# Altium schematic sheet 05_LMS1_Misc.SchDoc: LMS7002M misc (LMS1)
size A3; Organization: Lime Microsystems; Address1: Surrey Tech Centre; Address2: Guildford GU2 7YG; Address3: Surrey; Address4: United Kingdom; SheetNumber: 5
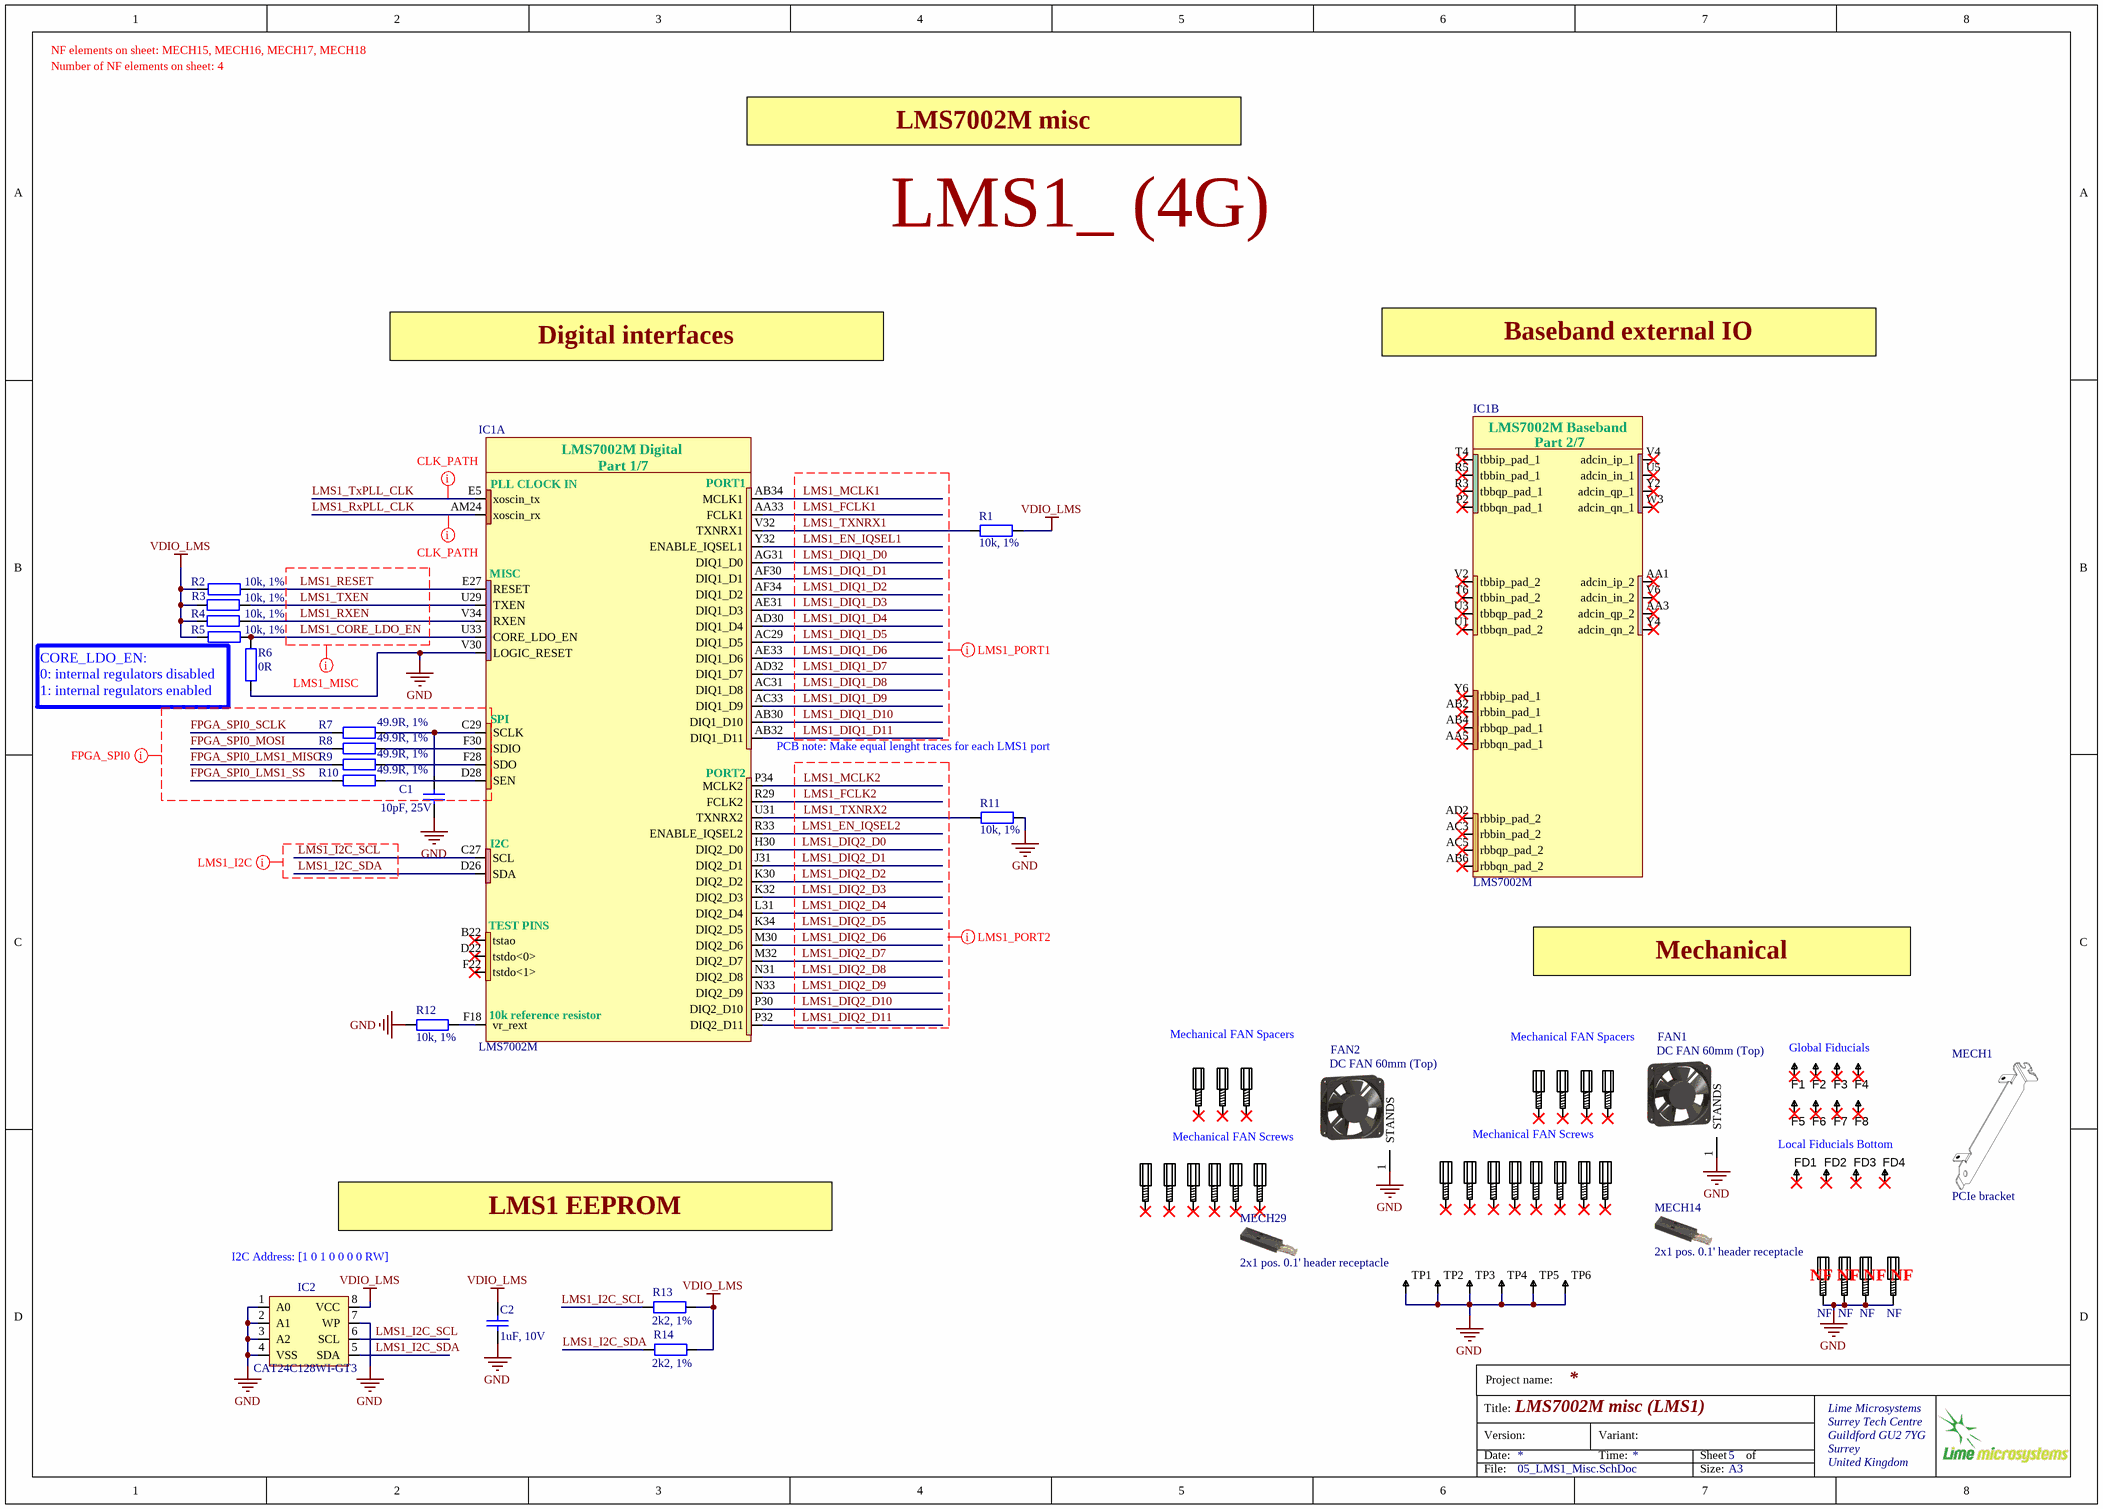
[diagram p0: 05_LMS1_Misc.SchDoc]

## Parts
C1  10pF, 25V  [CAP0402]
C2  1uF, 10V  [CAP0402]
F1  Fiducial  [Fiducial]  (value not drawn)
F2  Fiducial  [Fiducial]  (value not drawn)
F3  Fiducial  [Fiducial]  (value not drawn)
F4  Fiducial  [Fiducial]  (value not drawn)
F5  Fiducial  [Fiducial]  (value not drawn)
F6  Fiducial  [Fiducial]  (value not drawn)
F7  Fiducial  [Fiducial]  (value not drawn)
F8  Fiducial  [Fiducial]  (value not drawn)
FAN1  DC FAN 60mm (Top)  [FAN_60mm]
FAN2  DC FAN 60mm (Top)  [FAN_60mm]
FD1  Fiducial  [Fiducial_local]  (value not drawn)
FD2  Fiducial  [Fiducial_local]  (value not drawn)
FD3  Fiducial  [Fiducial_local]  (value not drawn)
FD4  Fiducial  [Fiducial_local]  (value not drawn)
IC1  LMS7002M  [LMS7002M_v5]  (parts A,B of 7)
IC2  CAT24C128WI-GT3  [SOIC127P600-8DL_v2]
MECH1  PCIe bracket  [PCIe_bracket]  (mechanical)
MECH2  Spacer M3  (value not drawn)  (mechanical)
MECH3  Spacer M3  (value not drawn)  (mechanical)
MECH4  Spacer M3  (value not drawn)  (mechanical)
MECH5  Spacer M3  (value not drawn)  (mechanical)
MECH6  Screws M3  (value not drawn)  (mechanical)
MECH7  Screws M3  (value not drawn)  (mechanical)
MECH8  Screws M3  (value not drawn)  (mechanical)
MECH9  Screws M3  (value not drawn)  (mechanical)
MECH10  Screws M3  (value not drawn)  (mechanical)
MECH11  Screws M3  (value not drawn)  (mechanical)
MECH12  Screws M3  (value not drawn)  (mechanical)
MECH13  Screws M3  (value not drawn)  (mechanical)
MECH14  2x1 pos. 0.1' header receptacle  (mechanical)
MECH15  Assembly Info: NF  [PCB_standoff]  (hidden comment: Standoff)
MECH16  Assembly Info: NF  [PCB_standoff]  (hidden comment: Standoff)
MECH17  Assembly Info: NF  [PCB_standoff]  (hidden comment: Standoff)
MECH18  Assembly Info: NF  [PCB_standoff]  (hidden comment: Standoff)
MECH20  Spacer M3  (value not drawn)  (mechanical)
MECH21  Spacer M3  (value not drawn)  (mechanical)
MECH22  Spacer M3  (value not drawn)  (mechanical)
MECH23  Screws M3  (value not drawn)  (mechanical)
MECH24  Screws M3  (value not drawn)  (mechanical)
MECH25  Screws M3  (value not drawn)  (mechanical)
MECH26  Screws M3  (value not drawn)  (mechanical)
MECH27  Screws M3  (value not drawn)  (mechanical)
MECH28  Screws M3  (value not drawn)  (mechanical)
MECH29  2x1 pos. 0.1' header receptacle  (mechanical)
R1  10k, 1%  [RES0402]
R2  10k, 1%  [RES0402]
R3  10k, 1%  [RES0402]
R4  10k, 1%  [RES0402]
R5  10k, 1%  [RES0402]
R6  0R  [RES0402]
R7  49.9R, 1%  [RES0402]
R8  49.9R, 1%  [RES0402]
R9  49.9R, 1%  [RES0402]
R10  49.9R, 1%  [RES0402]
R11  10k, 1%  [RES0402]
R12  10k, 1%  [RES0402]
R13  2k2, 1%  [RES0402]
R14  2k2, 1%  [RES0402]
TP1  TESTPOINT_THT_MINI  [TP-SMD-LOW_PROFILE]  (value not drawn)
TP2  TESTPOINT_THT_MINI  [TP-SMD-LOW_PROFILE]  (value not drawn)
TP3  TESTPOINT_THT_MINI  [TP-SMD-LOW_PROFILE]  (value not drawn)
TP4  TESTPOINT_THT_MINI  [TP-SMD-LOW_PROFILE]  (value not drawn)
TP5  TESTPOINT_THT_MINI  [TP-SMD-LOW_PROFILE]  (value not drawn)
TP6  TESTPOINT_THT_MINI  [TP-SMD-LOW_PROFILE]  (value not drawn)

## Nets
GND: C1.2 C2.2 FAN1.1(STANDS) FAN2.1(STANDS) IC1.V30(LOGIC_RESET) IC2.1(A0) IC2.2(A1) IC2.3(A2) IC2.4(VSS) IC2.7(WP) MECH15.MH1 MECH16.MH1 MECH17.MH1 MECH18.MH1 R6.1 R11.1 R12.2 TP1.1 TP2.1 TP3.1 TP4.1 TP5.1 TP6.1
VDIO_LMS: C2.1 IC2.8(VCC) R1.2 R2.2 R3.1 R4.1 R5.2 R13.1 R14.1
FPGA_SPI0_LMS1_MISO: R9.2
FPGA_SPI0_LMS1_SS: R10.2
FPGA_SPI0_MOSI: R8.2
FPGA_SPI0_SCLK: R7.2
LMS1_CORE_LDO_EN: IC1.U33(CORE_LDO_EN) R5.1 R6.2
LMS1_DIQ1_D0: IC1.AG31(DIQ1_D0)
LMS1_DIQ1_D1: IC1.AF30(DIQ1_D1)
LMS1_DIQ1_D2: IC1.AF34(DIQ1_D2)
LMS1_DIQ1_D3: IC1.AE31(DIQ1_D3)
LMS1_DIQ1_D4: IC1.AD30(DIQ1_D4)
LMS1_DIQ1_D5: IC1.AC29(DIQ1_D5)
LMS1_DIQ1_D6: IC1.AE33(DIQ1_D6)
LMS1_DIQ1_D7: IC1.AD32(DIQ1_D7)
LMS1_DIQ1_D8: IC1.AC31(DIQ1_D8)
LMS1_DIQ1_D9: IC1.AC33(DIQ1_D9)
LMS1_DIQ1_D10: IC1.AB30(DIQ1_D10)
LMS1_DIQ1_D11: IC1.AB32(DIQ1_D11)
LMS1_DIQ2_D0: IC1.H30(DIQ2_D0)
LMS1_DIQ2_D1: IC1.J31(DIQ2_D1)
LMS1_DIQ2_D2: IC1.K30(DIQ2_D2)
LMS1_DIQ2_D3: IC1.K32(DIQ2_D3)
LMS1_DIQ2_D4: IC1.L31(DIQ2_D4)
LMS1_DIQ2_D5: IC1.K34(DIQ2_D5)
LMS1_DIQ2_D6: IC1.M30(DIQ2_D6)
LMS1_DIQ2_D7: IC1.M32(DIQ2_D7)
LMS1_DIQ2_D8: IC1.N31(DIQ2_D8)
LMS1_DIQ2_D9: IC1.N33(DIQ2_D9)
LMS1_DIQ2_D10: IC1.P30(DIQ2_D10)
LMS1_DIQ2_D11: IC1.P32(DIQ2_D11)
LMS1_EN_IQSEL1: IC1.Y32(ENABLE_IQSEL1)
LMS1_EN_IQSEL2: IC1.R33(ENABLE_IQSEL2)
LMS1_FCLK1: IC1.AA33(FCLK1)
LMS1_FCLK2: IC1.R29(FCLK2)
LMS1_I2C_SCL: IC1.C27(SCL) IC2.6(SCL) R13.2
LMS1_I2C_SDA: IC1.D26(SDA) IC2.5(SDA) R14.2
LMS1_MCLK1: IC1.AB34(MCLK1)
LMS1_MCLK2: IC1.P34(MCLK2)
LMS1_RESET: IC1.E27(RESET) R2.1
LMS1_RXEN: IC1.V34(RXEN) R4.2
LMS1_RxPLL_CLK: IC1.AM24(xoscin_rx)
LMS1_TXEN: IC1.U29(TXEN) R3.2
LMS1_TXNRX1: IC1.V32(TXNRX1) R1.1
LMS1_TXNRX2: IC1.U31(TXNRX2) R11.2
LMS1_TxPLL_CLK: IC1.E5(xoscin_tx)
NetC1_1: C1.1 IC1.C29(SCLK) R7.1
NetIC1_D28: IC1.D28(SEN) R10.1
NetIC1_F18: IC1.F18(vr_rext) R12.1
NetIC1_F28: IC1.F28(SDO) R9.1
NetIC1_F30: IC1.F30(SDIO) R8.1

Not connected (* = marked no-connect by the designer): F1 1*; F2 1*; F3 1*; F4 1*; F5 1*; F6 1*; F7 1*; F8 1*; FD1 1*; FD2 1*; FD3 1*; FD4 1*; IC1 AA1(adcin_ip_2)* AA3(adcin_qp_2)* AA5(rbbqn_pad_1)* AB2(rbbin_pad_1)* AB4(rbbqp_pad_1)* AB6(rbbqn_pad_2)* AC3(rbbin_pad_2)* AC5(rbbqp_pad_2)* AD2(rbbip_pad_2)* B22(tstao)* D22(tstdo<0>)* F22(tstdo<1>)* P2(tbbqn_pad_1)* R3(tbbqp_pad_1)* R5(tbbin_pad_1)* T4(tbbip_pad_1)* T6(tbbin_pad_2)* U1(tbbqn_pad_2)* U3(tbbqp_pad_2)* U5(adcin_in_1)* V2(tbbip_pad_2)* V4(adcin_ip_1)* V6(adcin_in_2)* W3(adcin_qn_1)* Y2(adcin_qp_1)* Y4(adcin_qn_2)* Y6(rbbip_pad_1)*; MECH2 MH1*; MECH3 MH1*; MECH4 MH1*; MECH5 MH1*; MECH6 MH1*; MECH7 MH1*; MECH8 MH1*; MECH9 MH1*; MECH10 MH1*; MECH11 MH1*; MECH12 MH1*; MECH13 MH1*; MECH20 MH1*; MECH21 MH1*; MECH22 MH1*; MECH23 MH1*; MECH24 MH1*; MECH25 MH1*; MECH26 MH1*; MECH27 MH1*; MECH28 MH1*

## Layout directives
net class CLK_PATH: LMS1_RxPLL_CLK, LMS1_TxPLL_CLK
net class FPGA_SPI0: FPGA_SPI0_LMS1_MISO, FPGA_SPI0_LMS1_SS, FPGA_SPI0_MOSI, FPGA_SPI0_SCLK
net class LMS1_I2C: LMS1_I2C_SCL, LMS1_I2C_SDA
net class LMS1_PORT2: LMS1_DIQ2_D0, LMS1_DIQ2_D1, LMS1_DIQ2_D2, LMS1_DIQ2_D3, LMS1_DIQ2_D4, LMS1_DIQ2_D5, LMS1_DIQ2_D6, LMS1_DIQ2_D7, LMS1_DIQ2_D8, LMS1_DIQ2_D9, LMS1_DIQ2_D10, LMS1_DIQ2_D11, LMS1_EN_IQSEL2, LMS1_FCLK2, LMS1_MCLK2, LMS1_TXNRX2
net class LMS1_PORT1: LMS1_DIQ1_D0, LMS1_DIQ1_D1, LMS1_DIQ1_D2, LMS1_DIQ1_D3, LMS1_DIQ1_D4, LMS1_DIQ1_D5, LMS1_DIQ1_D6, LMS1_DIQ1_D7, LMS1_DIQ1_D8, LMS1_DIQ1_D9, LMS1_DIQ1_D10, LMS1_DIQ1_D11, LMS1_EN_IQSEL1, LMS1_FCLK1, LMS1_MCLK1, LMS1_TXNRX1
net class LMS1_MISC: LMS1_CORE_LDO_EN, LMS1_RESET, LMS1_RXEN, LMS1_TXEN

## Notes on the sheet
- NF elements on sheet: MECH15, MECH16, MECH17, MECH18
- Number of NF elements on sheet: 4
- LMS7002M misc
- LMS1_ (4G)
- Digital interfaces
- Baseband external IO
- (near R5) CORE_LDO_EN:
  0: internal regulators disabled
  1: internal regulators enabled
- (near IC1) PCB note: Make equal lenght traces for each LMS1 port
- Mechanical
- Mechanical FAN Spacers
- Global Fiducials
- Mechanical FAN Screws
- Local Fiducials Bottom
- (near IC2) I2C Address: [1 0 1 0 0 0 0 RW]
- LMS1 EEPROM
- NF
- Project name:
- Title:
- Version:
- Date:
- Variant:
- Time:
- Sheet
- of
- File:
- Size:
- A3
- (in symbol LMS7002Mr4, part A) LMS7002M Digital; Part 1/7; PLL CLOCK IN; PORT1; MISC; SPI; PORT2; I2C; TEST PINS; 10k reference resistor
- (in symbol LMS7002Mr4, part B) LMS7002M Baseband; Part 2/7

## Library data of the parts
C1 = Cap_0402: Manufacturer Part Number 1: 04023A100JAT2A; Manufacturer: AVX; Part Description: 10pF ±5% 25V C0G, NP0 Ceramic Capacitor -55°C ~ 125°C Surface Mount, MLCC 0402 (1005 Metric) 0.039" L x 0.020" W (1.00mm x 0.50mm); Capacitance Tolerance: ± 5%; Voltage Rating: 25; Ceramic Capacitor Case: 0402 [1005 Metric]; Capacitor Case Style: 0402 [1005 Metric]<!--FANDB--><div class="features-and-benefits-container"></div>; Dielectric Characteristic: C0G / NP0; SVHC: No SVHC (16-Jun-2014); Capacitance: 10; Value: 10pF, 25V; Supplier 1: Farnell; Supplier Part Number 1: 2332478RL; Product Range: -; RoHS: YES; Operating Temperature Min: -55; Operating Temperature Max: 125; Capacitance Tolerance ±: ± 5%; MSL: MSL 1 - Unlimited; Packaging: Cut Tape
C2 = Cap_0402: Manufacturer Part Number 1: C1005X5R1E105K050BC; Manufacturer: TDK; Part Description: 1µF ±10% 10V X5R Ceramic Capacitor -55°C ~ 85°C Surface Mount, MLCC 0402 (1005 Metric) 0.039" L x 0.020" W (1.00mm x 0.50mm); Voltage Rating: 10; Capacitance Tolerance: ± 10%; Product Range: TDK - C Series; Ceramic Capacitor Case: 0402 [1005 Metric]; Capacitance: 1; Dielectric Characteristic: X6; Value: 1uF, 10V; Supplier 1: Digi-Key; Supplier Part Number 1: 445-9066-1-ND; MSL: -; RoHS: YES
FAN1 FAN2 = 12V_DC_FAN: Part Description: Fan Tubeaxial 12VDC Square - 60mm L x 60mm H Vapo-Bearing™ 12.7 CFM (0.356m³/min) 2 Wire Leads; Manufacturer: Sunon; Manufacturer Part Number 1: HA60151V4-1000U-A99; ComponentLink1URL: http://www.orionfans.com/media/parts/dcfans/OD6025%20Final.pdf; ComponentLink1Description: http://www.orionfans.com/media/parts/dcfans/OD6025%20Final.pdf; Supplier 1: Digi-Key; Supplier Part Number 1: 259-1792-ND; Stock 1: 93; Pricing 1: 1=6,04000, 10=5,53300, 25=5,03000, 50=4,65260, 100=4,14960, 250=3,96096, 500=3,70948 (USD); RoHS: Yes; ComponentLink2URL: http://www.sunon.com/uFiles/file/03_products/08-catalog%20download/Sunon%20DC%20Brushless%20Fan%20&amp;%20Blower_(240-E).pdf?src-supplier=Digi-Key; ComponentLink2Description: http://www.sunon.com/uFiles/file/03_products/08-catalog%20download/Sunon%20DC%20Brushless%20Fan%20&amp;%20Blower_(240-E).pdf?src-supplier=Digi-Key
IC1 = LMS7002Mr4: Schematic symbol revision 4. Default footprint - 0.31mm pad; Manufacturer: Lime Microsystems; Part Description: IC FPRF Transceiver LMS7002M; 261 pin aQFN; Supplier 1: Lime Microsystems; Supplier Part Number 1: LMS7002M; Manufacturer Part Number 1: LMS7002M
IC2 = 24FC64F: Part Description: EEPROM Memory IC 128Kb (16K x 8) I²C 1MHz 400ns 8-SOIC; Manufacturer: ON Semiconductor; Memory Type: Non-Volatile; Memory Format: EEPROM; Memory Size: 128Kb (16K x 8); Write Cycle Time - Word, Page: 5ms; Memory Interface: I²C; Voltage - Supply: 1.8 V ~ 5.5 V; Supplier 1: Digi-Key; Supplier Part Number 1: CAT24C128WI-GT3CT-ND; Manufacturer Part Number 1: CAT24C128WI-GT3; RoHS: RoHS Compliant; Category: Integrated Circuits (ICs); Stock 1: 14804; Pricing 1: 1=0.31, 10=0.309, 100=0.2532, 500=0.24616, 1000=0.23956 (USD); Packaging: Cut Tape (CT); Part Status: Active; Technology: EEPROM; Operating Temperature: -40°C ~ 85°C (TA); Mounting Type: Surface Mount; Package / Case: 8-SOIC (0.154", 3.90mm Width); Supplier Device Package: 8-SOIC; Base Part Number: CAT24C128; ComponentLink1URL: http://www.onsemi.com/pub/Collateral/CAT24C128-D.PDF; ComponentLink1Description: http://www.onsemi.com/pub/Collateral/CAT24C128-D.PDF
MECH1 = PCIe_bracket: Part Description: BRACKET COMPUTER EISA/ISA OR PCI; Manufacturer: Keystone Electronics; Manufacturer Part Number 1: 9200; Body Material: Steel; ComponentLink1URL: http://www.keyelco.com/product-pdf.cfm?p=2468; ComponentLink1Description: http://www.keyelco.com/product-pdf.cfm?p=2468; Supplier 1: Digi-Key; Supplier Part Number 1: 36-9200-ND; Stock 1: 36909; Pricing 1: 1=2,08000, 10=1,88700, 50=1,69400, 250=1,46300, 1000=1,34000, 2500=1,16000, 5000=1,02410 (USD); RoHS: Yes; Mount: Brackets; Material: Steel; Package Quantity: 1; Packaging: Bulk; Length: 120.02mm; Width: 0.725inch; REACH SVHC: No SVHC; ComponentLink2URL: https://datasheet.ciiva.com/1624/88095-1624695.pdf?src-supplier=Element14; ComponentLink2Description: https://datasheet.ciiva.com/1624/88095-1624695.pdf?src-supplier=Element14; ComponentLink3URL: https://datasheet.ciiva.com/4667/9200-292546-4667239.pdf?src-supplier=Mouser; ComponentLink3Description: https://datasheet.ciiva.com/4667/9200-292546-4667239.pdf?src-supplier=Mouser; ComponentLink4URL: https://datasheet.ciiva.com/18415/70183120-18415751.pdf?src-supplier=Allied+Electronics; ComponentLink4Description: https://datasheet.ciiva.com/18415/70183120-18415751.pdf?src-supplier=Allied+Electronics
MECH2-MECH5 MECH20-MECH22 = STANDOFF_M-F_THREADED_M3x8x10mm_HEX_5mm dia: STANDOFF M/F MET 5MM HEX 10MM L; Manufacturer: BOSSARD; Manufacturer Part Number 1: TDYSFF-M3/10; Part Description: Screwed spacer sleeve; Int.thread: M3; 25mm; brass; Supplier 1: TME; Supplier Part Number 1: TDYSFF-M3/10
MECH6-MECH13 MECH23-MECH28 = STANDOFF_M-F_THREADED_M3x8x10mm_HEX_5mm dia: STANDOFF M/F MET 5MM HEX 10MM L; Manufacturer: BOSSARD; Manufacturer Part Number 1: 1003755; Part Description: Screw; M3x6; DIN:912; Head: cheese head; imbus; steel; zinc; Supplier 1: TME; Supplier Part Number 1: 1003755
MECH14 MECH29 = Header_1x2_receptacle: Part Description: 2 Position Rectangular Receptacle Connector IDC Gold 24 AWG; Manufacturer: Molex; Manufacturer Part Number 1: 0014562021; Contact Resistance: 15mR; Max Voltage Rating (DC): 250.25kV; Current Rating: 3A; Voltage Rating: 250V; Connector Type: Receptacle,Socket,IDC; Number of Positions: 2; Wire/Cable Type: Discrete,Ribbon; Wire/Cable Gauge: 24AWG; Pitch: 2.54mm; Glow Wire Compliant: Non-compliant; Supplier 1: Digi-Key; Supplier Part Number 1: 23-0014562021-ND; Stock 1: 5637; Pricing 1: 2=0,78000, 10=0,68600, 26=0,64577, 50=0,61880, 100=0,59180, 250=0,53800, 500=0,48420, 1000=0,43040, 2500=0,39005 (USD); RoHS: Yes; Mount: Free Hanging,Cable; Contact Plating: Gold; Contact Material: Bronze; Color: Black; Housing Color: Black; Housing Material: Polyester; Min Operating Temperature: -40°C; Max Operating Temperature: 105°C; Number of Rows: 1; Contact Gender: Female; Package Quantity: 1; Packaging: Rail/Tube; Termination: IDT; Number of Contacts: 2; Orientation: Straight; Number of Circuits: 2; Length: 5.05mm; Height: 15.2mm; Width: 2.51mm; Lead Free: Lead Free; ComponentLink1URL: https://datasheet.ciiva.com/5162/0014562021-rb-cbl-wr-trp-conn-156807-5162409.pdf?src-supplier=Mouser; ComponentLink1Description: https://datasheet.ciiva.com/5162/0014562021-rb-cbl-wr-trp-conn-156807-5162409.pdf?src-supplier=Mouser; ComponentLink2URL: https://datasheet.ciiva.com/702/014562021-sd-702522.pdf?src-supplier=Digi-Key; ComponentLink2Description: https://datasheet.ciiva.com/702/014562021-sd-702522.pdf?src-supplier=Digi-Key; ComponentLink3URL: https://datasheet.ciiva.com/30109/85530014562021-rb-cbl-wr-trp-n-30109738.pdf?src-supplier=Onlinecomponents.com; ComponentLink3Description: https://datasheet.ciiva.com/30109/85530014562021-rb-cbl-wr-trp-n-30109738.pdf?src-supplier=Onlinecomponents.com
MECH15-MECH18 = STANDOFF_M-F_THREADED_M3x8x10mm_HEX_5mm dia: STANDOFF M/F MET 5MM HEX 10MM L; Manufacturer: FIX&FASTEN; Manufacturer Part Number 1: FIX-MAE-5TV; Part Description: PCB distance; polyamide; L:5mm; Colour: natural; Øcutout:3mm; Unit: pcs; SuppliedAmount: 1000; MinAmount: 10; Type of spacer: PCB distance; Panel cutout diameter: 3mm; Spanner size: 5.5mm; Internal thread: M3; Thread pitch: 0,5; Supplier 1: TME; Supplier Part Number 1: FIX-MAE-5TV; Category: Plastic Pegs; Weight: 0.145; Multiples: 10; Material: polyamide; Spacer length: 5mm; Price Type: NET
R1-R5 R11 R12 = Res_0402: Manufacturer: Yageo; Manufacturer Part Number 1: RC0402FR-0710KL; Part Description: RES SMD 10K OHM 1% 1/16W 0402; Temperature Coefficient: ±100ppm/°C; Power (Watts): 0.063W, 1/16W; Value: 10k, 1%; Supplier 1: Digi-Key; Supplier Part Number 1: 311-10.0KLRTR-ND; Resistance (Ohms): 10k; Packaging: Tape & Reel (TR); RoHS: RoHS Compliant; Package / Case: 0402 (1005 Metric); Tolerance: ±1%; Operating Temperature: -55°C ~ 155°C; Size / Dimension: 0.039" L x 0.020" W (1.00mm x 0.50mm); Number of Terminations: 2; Category: Resistors; Height: 0.016" (0.40mm); Supplier Device Package: 0402; Features: Moisture Resistant; Composition: Thick Film
R6 = Res_0402: Manufacturer Part Number 1: RC0402JR-070RL; Manufacturer: Yageo; Part Description: RES SMD 0.0OHM JUMPER 1/16W 0402; Resistance (Ohms): 0.0; Tolerance: Jumper; Power (Watts): 0.063W, 1/16W; Value: 0R; Supplier 1: Digi-Key; Supplier Part Number 1: 311-0.0JRTR-ND; Category: Resistors; Temperature Coefficient: -; Features: Moisture Resistant; Supplier Device Package: 0402; Height: 0.016" (0.40mm); Package / Case: 0402 (1005 Metric); Operating Temperature: -55°C ~ 155°C; Size / Dimension: 0.039" L x 0.020" W (1.00mm x 0.50mm); Composition: Thick Film; Packaging: Tape & Reel (TR); Number of Terminations: 2; RoHS: RoHS Compliant
R7-R10 = Res_0402: Manufacturer: Samsung Electro-Mechanics America, Inc.; Manufacturer Part Number: RC1005F49R9CS; Part Description: RES SMD 49.9 OHM 1% 1/16W 0402; Temperature Coefficient: ±100ppm/°C; Resistance (Ohms): 49.9; Power (Watts): 0.063W, 1/16W; Number of Terminations: 2; Size / Dimension: 0.039" L x 0.020" W (1.00mm x 0.50mm); Supplier Device Package: 0402 (1005 Metric); RoHS: RoHS Compliant; Supplier Part Number 1: 1276-3469-6-ND; Features: -; Packaging: Digi-Reel®; Tolerance: ±1%; Height: 0.016" (0.40mm); Category: Resistors; Composition: Thick Film; Package / Case: 0402 (1005 Metric); Supplier 1: Digi-Key; Operating Temperature: -55°C ~ 155°C; Value: 49.9R, 1%; Manufacturer Part Number 1: RC1005F49R9CS
R13 R14 = Res_0402: Manufacturer: Stackpole Electronics Inc; Manufacturer Part Number 1: RMCF0402FT2K20; Part Description: RES SMD 2.2K OHM 1% 1/16W 0402; Resistance (Ohms): 2.2k; Temperature Coefficient: ±100ppm/°C; Power (Watts): 0.063W, 1/16W; Value: 2k2, 1%; Supplier 1: Digi-Key; Supplier Part Number 1: RMCF0402FT2K20CT-ND; Supplier Device Package: 0402; Package / Case: 0402 (1005 Metric); Size / Dimension: 0.039" L x 0.020" W (1.00mm x 0.50mm); Operating Temperature: -55°C ~ 155°C; Composition: Thick Film; Category: Resistors; Features: -; Height: 0.016" (0.40mm); RoHS: RoHS Compliant; Number of Terminations: 2; Packaging: Cut Tape (CT); Tolerance: ±1%
TP1-TP6 = TESTPOINT_THT_MINI: Test Point PCB mount Miniature White; Manufacturer Part Number 1: S1751-46R; Manufacturer: Harwin Inc; Part Description: Natural PC Test Point 0.128" x 0.065" x 0.079" (3.25mm x 1.65mm x 2.00mm) Brass, Tin Plating Surface Mount Mounting Type; Supplier 1: Digi-Key; Supplier Part Number 1: 952-1478-2-ND; RoHS: RoHS Compliant; Color: Natural; Material: Copper Alloy; Mounting Type: Surface Mount; Terminal: 0.128" x 0.065" x 0.079" (3.25mm x 1.65mm x 2.00mm) Brass, Tin Plated; Type: PC Test Point; Packaging: Tape & Reel (TR); Category: Test and Measurement